# EAGLE design Datalogger (EAGLE 6.5.0)
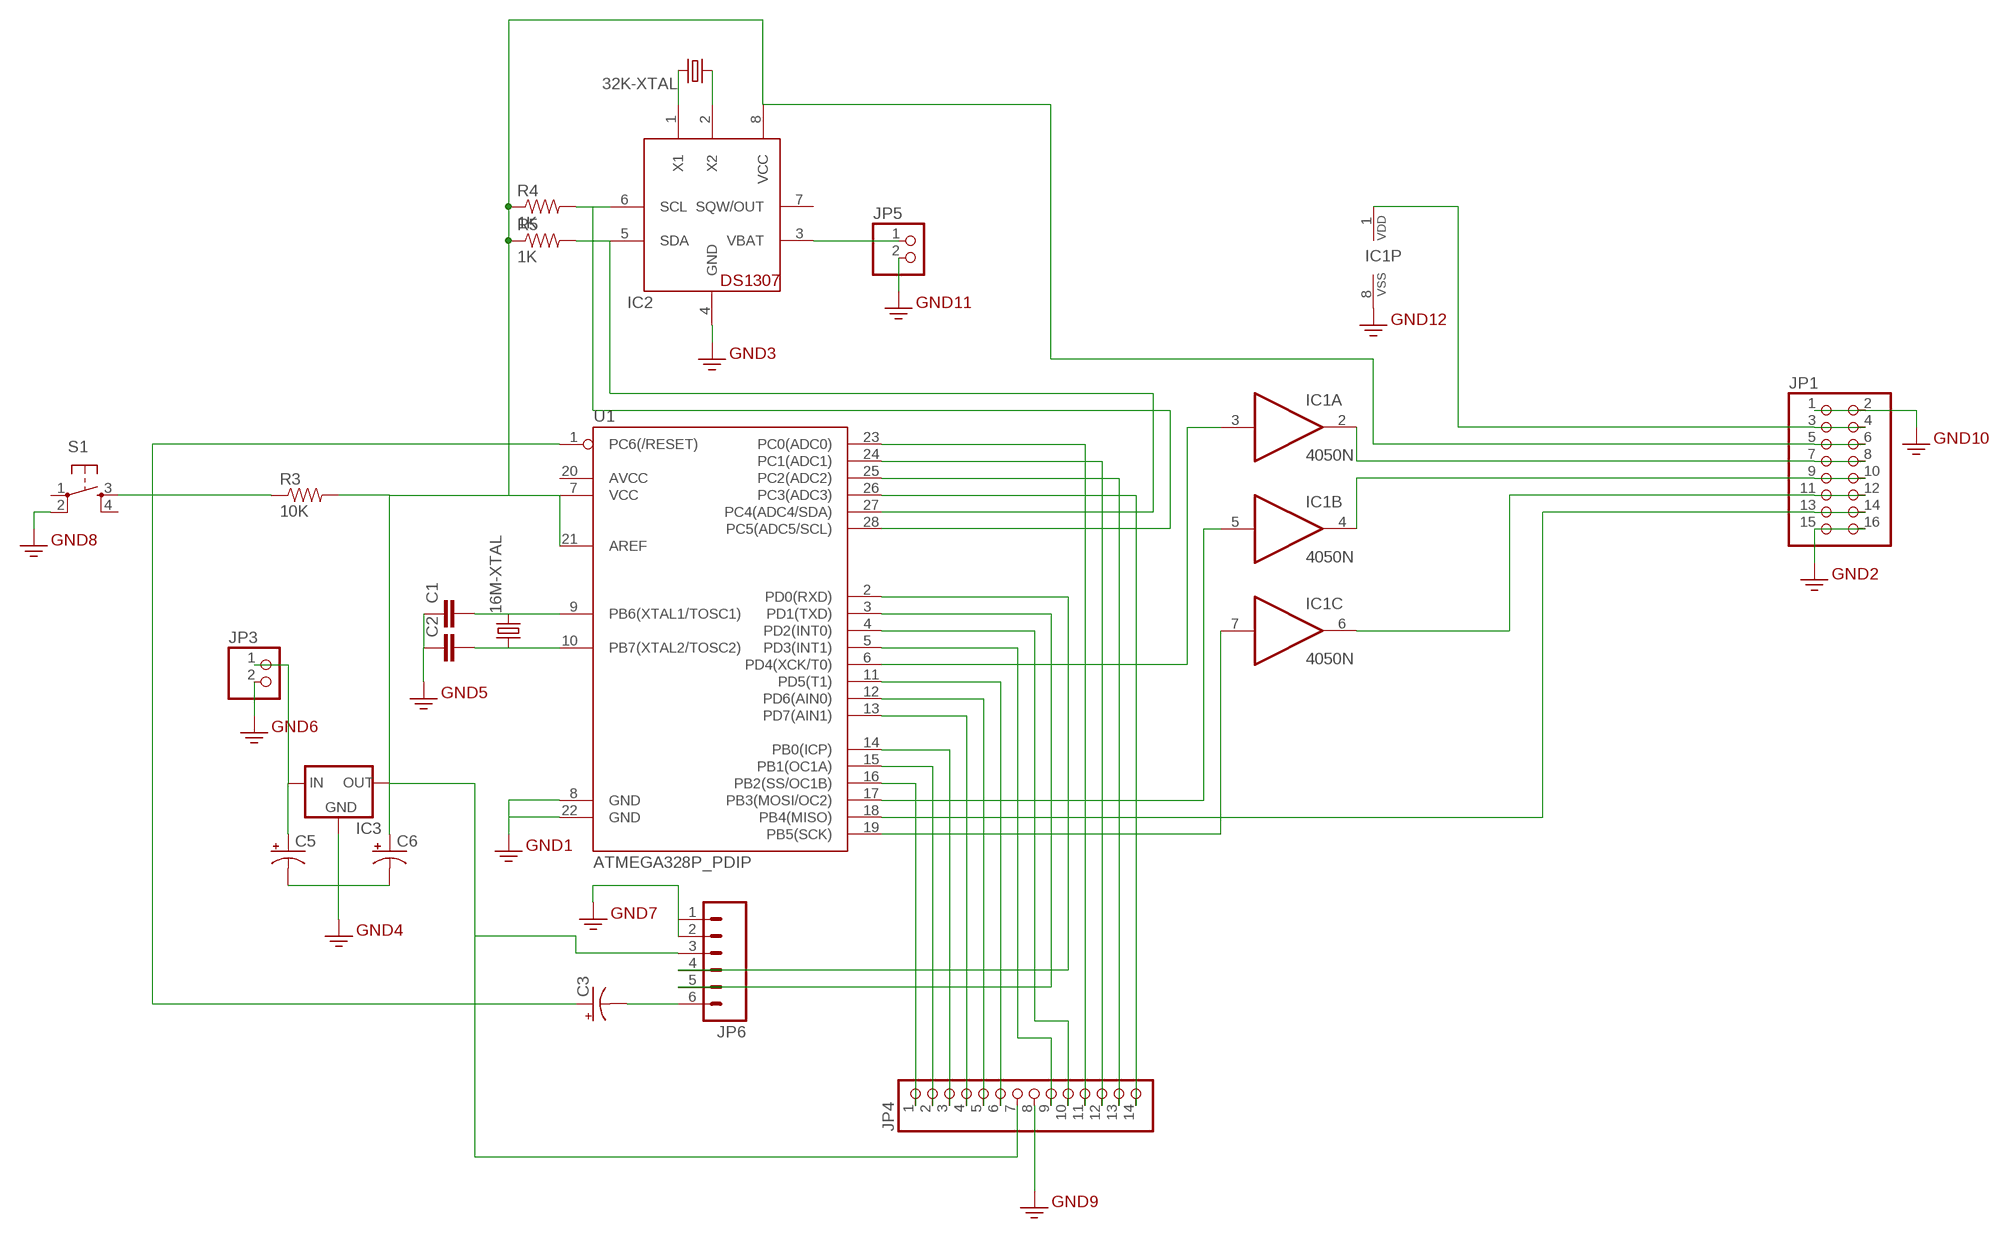
[diagram p0: schematic, sheet 1]

## Parts
16M-XTAL  CRYSTALHC49US  [HC49US]
32K-XTAL  CRYSTALTC26H_EZ  [TC26HEZ]
C1  CAPKIT  [CAP-PTH-SMALL-KIT]
C2  CAPKIT  [CAP-PTH-SMALL-KIT]
C3  CAP_POLPTH1  [CPOL-RADIAL-100UF-25V]
C5  CAP_POLPTH1  [CPOL-RADIAL-100UF-25V]
C6  CAP_POLPTH1  [CPOL-RADIAL-100UF-25V]
IC1  4050N  [DIL16]
IC2  DS1307  [DIL08]
IC3  V_REG_78XX-TO-220  [TO-220-ALT]
JP1  PINHD-2X8  [2X08]
JP3  PINHD-1X2  [1X02]
JP4  PINHD-1X14  [1X14]
JP5  PINHD-1X2  [1X02]
JP6  M06SIP  [1X06]
R3  10K  RESISTORPTH-1/4W  [AXIAL-0.4]
R4  1K  RESISTORPTH-1/4W  [AXIAL-0.4]
R5  1K  RESISTORPTH-1/4W  [AXIAL-0.4]
S1  TAC_SWITCHPTH  [TACTILE-PTH]
U1  ATMEGA328P_PDIP  [DIL28-3]

## Nets
3.3V: C1.1 C2.1 C5.2(-) C6.2(-) IC1.8(P:VSS) IC2.4(GND) IC3.GND JP1.1 JP1.2 JP1.15 JP1.16 JP3.2 JP4.8 JP5.2 JP6.1 JP6.2 S1.2 U1.8(GND) U1.22(GND) ; supply symbol labelled GND2
N$1: JP4.2 U1.15(PB1(OC1A))
N$2: 16M-XTAL.2 C1.2 U1.9(PB6(XTAL1/TOSC1))
N$3: 16M-XTAL.1 C2.2 U1.10(PB7(XTAL2/TOSC2))
N$4: IC1.2(A:O) JP1.7 JP1.8
N$5: IC1.4(B:O) JP1.9 JP1.10
N$6: IC1.6(C:O) JP1.11 JP1.12
N$7: JP1.13 JP1.14 U1.18(PB4(MISO))
N$8: C6.1(+) IC2.8(VCC) IC3.OUT JP1.5 JP1.6 JP4.7 JP6.3 R3.P$2 R4.P$1 R5.P$1 U1.7(VCC) U1.21(AREF)
N$9: IC1.1(P:VDD) JP1.3 JP1.4
N$10: IC1.3(A:I) U1.6(PD4(XCK/T0))
N$11: IC1.5(B:I) U1.17(PB3(MOSI/OC2))
N$12: IC1.7(C:I) U1.19(PB5(SCK))
N$13: 32K-XTAL.1 IC2.2(X2)
N$14: 32K-XTAL.2 IC2.1(X1)
N$15: IC2.6(SCL) R4.P$2 U1.28(PC5(ADC5/SCL))
N$16: C5.1(+) IC3.IN JP3.1
N$17: IC2.5(SDA) R5.P$2 U1.27(PC4(ADC4/SDA))
N$18: JP4.11 U1.23(PC0(ADC0))
N$19: IC2.3(VBAT) JP5.1
N$20: C3.2(-) JP6.6
N$21: JP4.12 U1.24(PC1(ADC1))
N$22: JP4.13 U1.25(PC2(ADC2))
N$23: JP4.14 U1.26(PC3(ADC3))
N$24: JP6.4 U1.2(PD0(RXD))
N$25: JP6.5 U1.3(PD1(TXD))
N$26: JP4.10 U1.4(PD2(INT0))
N$27: JP4.9 U1.5(PD3(INT1))
N$28: JP4.6 U1.11(PD5(T1))
N$29: JP4.5 U1.12(PD6(AIN0))
N$30: JP4.4 U1.13(PD7(AIN1))
N$31: JP4.3 U1.14(PB0(ICP))
N$32: C3.1(+) U1.1(PC6(/RESET))
N$33: JP4.1 U1.16(PB2(SS/OC1B))
N$35: R3.P$1 S1.3
Unconnected: IC1.9(D:I) IC1.10(D:O) IC1.11(E:I) IC1.12(E:O) IC1.14(F:I) IC1.15(F:O) IC2.7(SQW/OUT) S1.1 S1.4 U1.20(AVCC)

## Library data of the parts
16M-XTAL 32K-XTAL = SparkFun-FreqCtrl:CRYSTAL: Various standard crystals. Proven footprints. Spark Fun Electronics SKU : COM-00534
C1 C2 = SparkFun-Passives:CAP: Capacitor Standard 0603 ceramic capacitor, and 0.1" leaded capacitor.
C3 C5 C6 = SparkFun-Capacitors:CAP_POL: Capacitor Polarized These are standard SMD and PTH capacitors. Normally 10uF, 47uF, and 100uF in electrolytic and tantalum varieties. Always verify the external diameter of the through hole cap, it varies with capacity, voltage, and manufacturer. The EIA devices should be standard.
IC1 = 40xx:4050: Hex non-inverting BUFFER
IC2 = adafruit:DS1307: DS1307 Real time clock (RTC) with battery backup ability. Talk to it via i2c
IC3 = SparkFun-PowerIC:V_REG_78XX: Voltage Regulator Standard 7805 5V regulator. IGO (Input Ground Output). Spark Fun Electronics SKU : COM-00107
JP1 = pinhead:PINHD-2X8: PIN HEADER
JP3 JP5 = pinhead:PINHD-1X2: PIN HEADER
JP4 = adafruit:PINHD-1X14: PIN HEADER
JP6 = SparkFun-Connectors:M06: Header 6 Standard 6-pin 0.1" header. Use with straight break away headers (SKU : PRT-00116), right angle break away headers (PRT-00553), swiss pins (PRT-00743), machine pins (PRT-00117), and female headers (PRT-00115). Molex polarized connector foot print use with SKU : PRT-08094 with associated crimp pins and housings. NOTES ON THE VARIANTS LOCK and LOCK_LONGPADS... This footprint was designed to help hold the alignment of a through-hole component (i.e. 6-pin header) while soldering it into place. You may notice that each hole has been shifted either up or down by 0.005 of an inch from it's more standard position (which is a perfectly straight line). This slight alteration caused the pins (the squares in the middle) to touch the edges of the holes. Because they are alternating, it causes a "brace" to hold the component in place. 0.005 has proven to be the perfect amount of "off-center" position when using our standard breakaway headers. Although looks a little odd when you look at the bare footprint, once you have a header in there, the alteration is very hard to notice. Also,if you push a header all the way into place, it is covered up entirely on the bottom side. This idea of altering the position of holes to aid alignment will be further integrated into the Sparkfun Library for other footprints. It can help hold any component with 3 or more connection pins.
R3-R5 = SparkFun-Passives:RESISTOR: Resistor Basic schematic elements and footprints for 0603, 1206, and PTH resistors.
S1 = SparkFun-Electromechanical:TAC_SWITCH: Momentary Switch Button commonly used for reset or general input. Spark Fun Electronics SKU : COM-00097 SMT- SWCH-08247
U1 = SparkFun-DigitalIC:ATMEGA328P_PDIP: uC used in the Arduino 32kb flash, 1k EEPROM, 2k SRAM This is the through-hole version of this chip.

## Board
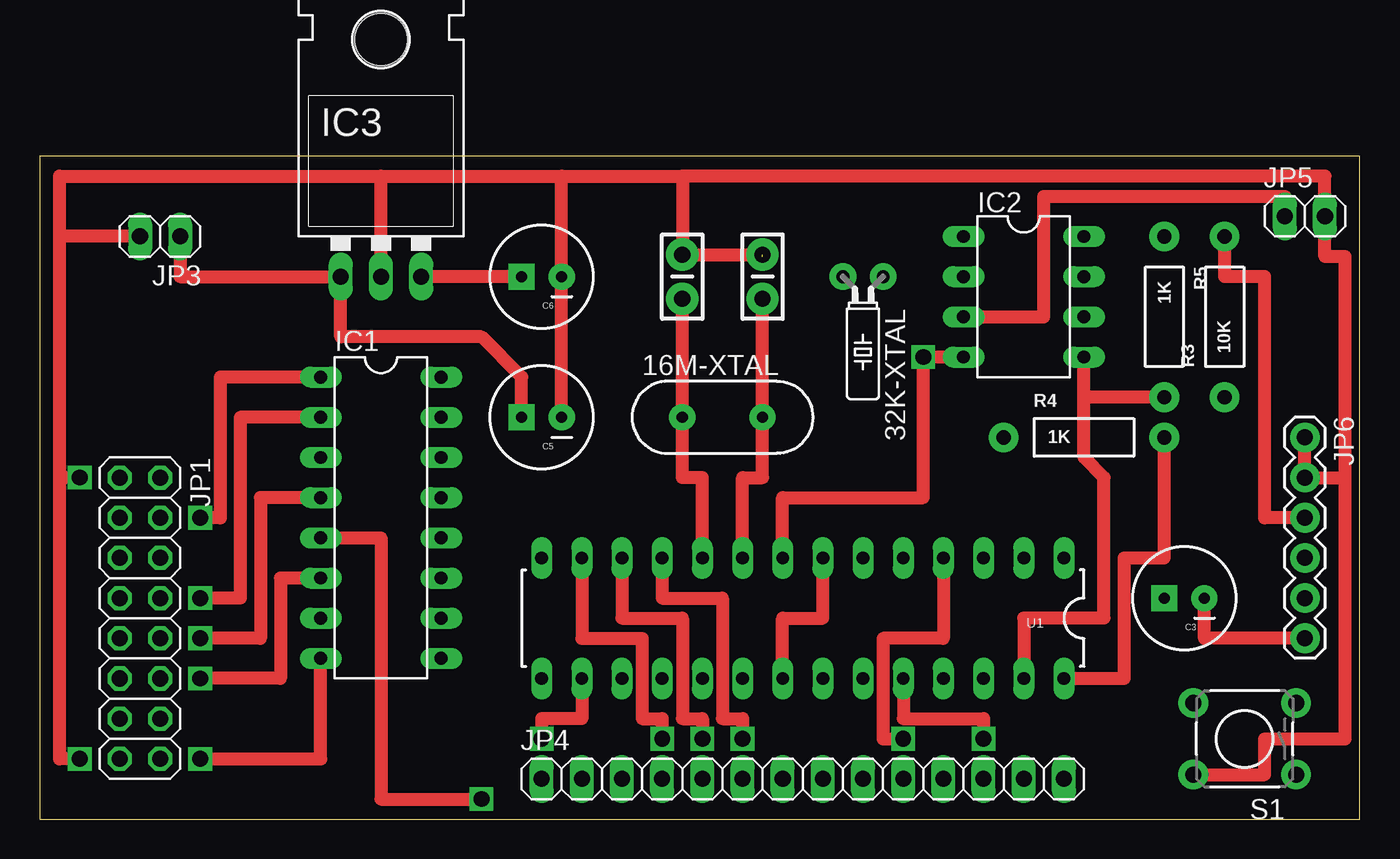
[diagram p1: board, top side]
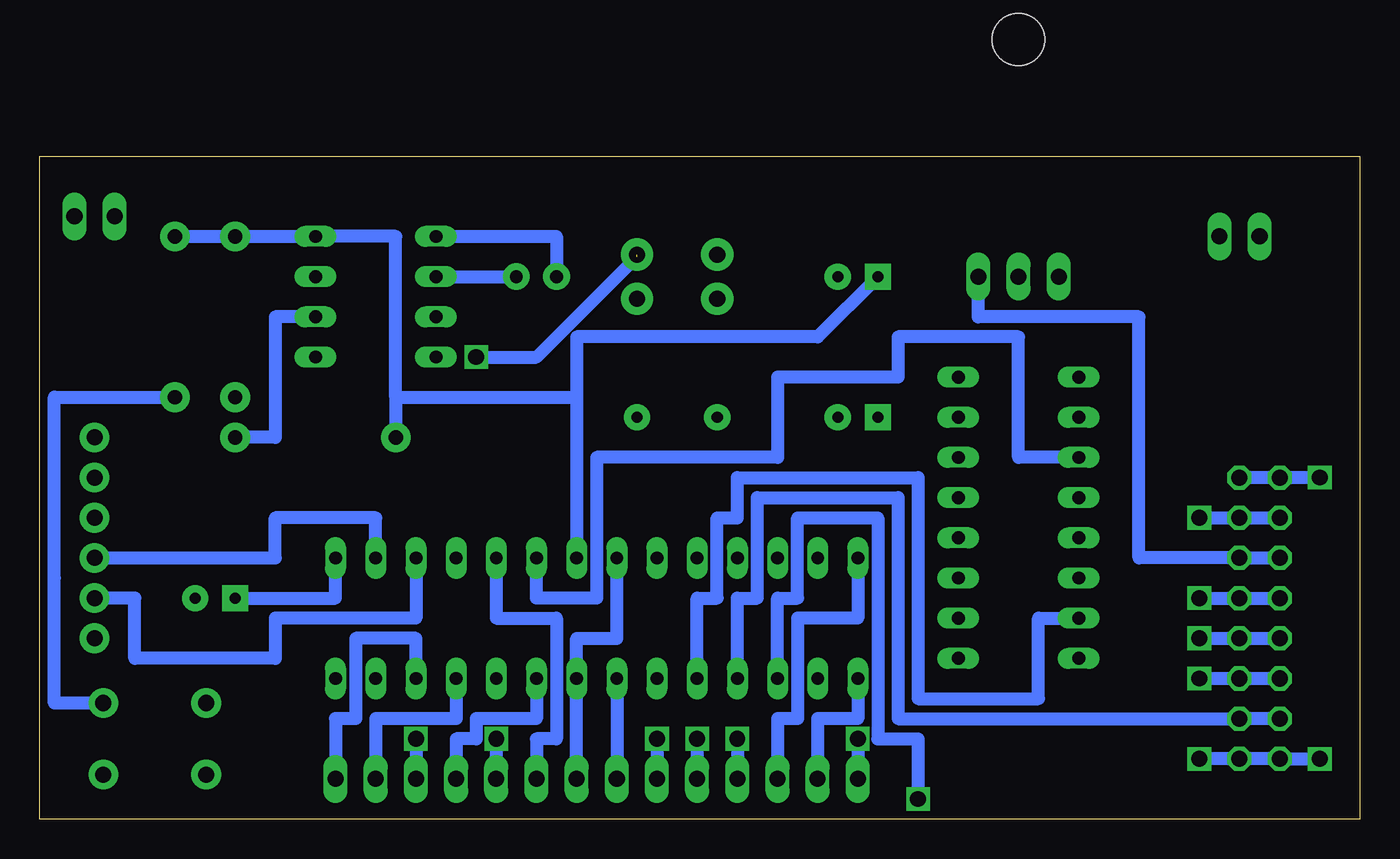
[diagram p2: board, bottom side, seen from below]

Size 83.49 x 41.9 mm. Coordinates in mm from the lower left corner, seen from the top.
Outline: 0,0 83.49,0 83.49,41.9 0,41.9 0,0
Copper layers (1*16): Top 0.035mm / dielectric 1.5mm / Bottom 0.035mm
Design rules "default": minimum track width 10mil, minimum drill 24mil, track to track 8mil, track to pad 8mil, pad to pad 8mil, via to via 8mil, smd to smd 8mil, copper to edge 40mil, drill to drill 8mil, minimum pad ring 10mil, minimum via ring 8mil, stop-mask expansion 4mil, vias tented up to drill 0mil, thermal gap 10mil

### Footprints (pad centres in the part's own frame; a part is rotated, then mirrored left to right if it is on the bottom)
HC49US = drill 0.7 pad 1.651: 1 -2.54,0; 2 2.54,0
TC26HEZ = drill 0.813 pad 1.676: 1 -1.27,0; 2 1.27,0
CAP-PTH-SMALL-KIT = drill 1.016 pad 2.032: 1 -1.397,0; 2 1.397,0
CPOL-RADIAL-100UF-25V = drill 0.7 pad 1.651 square: 1 1.27,0 | drill 0.7 pad 1.651: 2 -1.27,0
DIL16 = drill 0.813 long: 1 -8.89,-3.81; 2 -6.35,-3.81; 3 -3.81,-3.81; 4 -1.27,-3.81; 5 1.27,-3.81; 6 3.81,-3.81; 7 6.35,-3.81; 8 8.89,-3.81; 9 8.89,3.81; 10 6.35,3.81; 11 3.81,3.81; 12 1.27,3.81; 13 -1.27,3.81; 14 -3.81,3.81; 15 -6.35,3.81; 16 -8.89,3.81
DIL08 = drill 0.813 long: 1 -3.81,-3.81; 2 -1.27,-3.81; 3 1.27,-3.81; 4 3.81,-3.81; 5 3.81,3.81; 6 1.27,3.81; 7 -1.27,3.81; 8 -3.81,3.81
TO-220-ALT = drill 1.016 long: GND 0,-3.81; IN -2.54,-3.81; OUT 2.54,-3.81 | hole 3.302: 0,11.176
2X08 = drill 1.016 octagon: 1 -8.89,-1.27; 2 -8.89,1.27; 3 -6.35,-1.27; 4 -6.35,1.27; 5 -3.81,-1.27; 6 -3.81,1.27; 7 -1.27,-1.27; 8 -1.27,1.27; 9 1.27,-1.27; 10 1.27,1.27; 11 3.81,-1.27; 12 3.81,1.27; 13 6.35,-1.27; 14 6.35,1.27; 15 8.89,-1.27; 16 8.89,1.27
1X02 = drill 1.016 long: 1 -1.27,0; 2 1.27,0
1X14 = drill 1.016 long: 1 -16.51,0; 2 -13.97,0; 3 -11.43,0; 4 -8.89,0; 5 -6.35,0; 6 -3.81,0; 7 -1.27,0; 8 1.27,0; 9 3.81,0; 10 6.35,0; 11 8.89,0; 12 11.43,0; 13 13.97,0; 14 16.51,0
1X06 = drill 1.016 pad 1.88: 1 0,0; 2 2.54,0; 3 5.08,0; 4 7.62,0; 5 10.16,0; 6 12.7,0
AXIAL-0.4 = drill 0.9 pad 1.88: P$1 -5.08,0; P$2 5.08,0
TACTILE-PTH = drill 1.016 pad 1.88: 1 -3.251,2.261; 2 3.251,2.261; 3 -3.251,-2.261; 4 3.251,-2.261
DIL28-3 = drill 0.813 long: 1 -16.51,-3.81; 2 -13.97,-3.81; 3 -11.43,-3.81; 4 -8.89,-3.81; 5 -6.35,-3.81; 6 -3.81,-3.81; 7 -1.27,-3.81; 8 1.27,-3.81; 9 3.81,-3.81; 10 6.35,-3.81; 11 8.89,-3.81; 12 11.43,-3.81; 13 13.97,-3.81; 14 16.51,-3.81; 15 16.51,3.81; 16 13.97,3.81; 17 11.43,3.81; 18 8.89,3.81; 19 6.35,3.81; 20 3.81,3.81; 21 1.27,3.81; 22 -1.27,3.81; 23 -3.81,3.81; 24 -6.35,3.81; 25 -8.89,3.81; 26 -11.43,3.81; 27 -13.97,3.81; 28 -16.51,3.81

### Placement (x,y rotation side)
16M-XTAL  43.18,25.4 0 top
32K-XTAL  52.07,34.29 180 top
C1  45.72,34.29 270 top
C2  40.64,34.29 270 top
C3  72.39,13.97 180 top
C5  31.75,25.4 180 top
C6  31.75,34.29 180 top
IC1  21.59,19.05 270 top
IC2  62.23,33.02 270 top
IC3  21.59,38.1 0 top
JP1  6.35,12.7 270 top
JP3  7.62,36.83 180 top
JP4  48.26,2.54 0 top
JP5  80.01,38.1 0 top
JP6  80.01,24.13 270 top
R3  74.93,31.75 90 top
R4  66.04,24.13 0 top
R5  71.12,31.75 270 top
S1  76.2,5.08 180 top
U1  48.26,12.7 180 top

### Tracks (layer width: path | path; a pad name or v marks a point on that pad's centre or on a via)
3.3V  (via drill 1)  (1 unrouted)
  Top 0.813: v2.54,3.81 1.27,3.81 1.27,21.59 | 1.27,21.59 1.27,36.83 | 1.27,36.83 1.27,40.64 21.59,40.64 | C5.2 C6.2 33.02,40.64 | IC3.GND 21.59,40.64 | 21.59,40.64 33.02,40.64 | 33.02,40.64 40.64,40.64 | 40.64,40.64 C2.1 C1.1 | IC2.4 v55.88,29.21 55.88,20.32 46.99,20.32 U1.8 | JP3.2 1.27,36.83 | 40.64,40.64 81.28,40.64 JP5.2 81.28,35.56 82.55,35.56 82.55,21.59 | v2.54,21.59 1.27,21.59 | v10.16,3.81 17.78,3.81 IC1.8 | S1.2 77.47,2.82 77.47,5.08 82.55,5.08 82.55,21.59 | 82.55,21.59 JP6.2 JP6.1
  Bottom 0.813: v2.54,3.81 JP1.15 JP1.16 v10.16,3.81 | v55.88,29.21 52.07,29.21 45.72,35.56 | U1.8 46.99,11.43 49.53,11.43 U1.22 JP4.8 | v2.54,21.59 JP1.1 JP1.2
N$1
  Bottom 0.813: U1.15 31.75,6.35 34.29,6.35 JP4.2
N$2
  Top 0.813: U1.9 44.45,21.59 45.72,21.59 16M-XTAL.2 C1.2
N$3
  Top 0.813: U1.10 41.91,21.59 40.64,21.59 16M-XTAL.1 C2.2
N$4  (via drill 1)
  Top 0.813: IC1.2 12.7,25.4 12.7,13.97 | 12.7,13.97 v10.16,13.97 12.7,13.97
  Bottom 0.813: JP1.7 JP1.8 v10.16,13.97
N$5  (via drill 1)
  Top 0.813: IC1.4 13.97,20.32 13.97,11.43 v10.16,11.43
  Bottom 0.813: JP1.9 JP1.10 v10.16,11.43
N$6  (via drill 1)
  Top 0.813: IC1.6 15.24,15.24 15.24,8.89 v10.16,8.89
  Bottom 0.813: v10.16,8.89 JP1.12 JP1.11
N$7
  Bottom 0.813: U1.18 39.37,13.97 38.1,13.97 38.1,20.32 29.21,20.32 29.21,6.35 JP1.14 JP1.13
N$8
  Top 0.813: C6.1 IC3.OUT | U1.21 46.99,12.7 49.53,12.7 U1.7 | JP6.3 77.47,19.05 77.47,34.29 74.93,34.29 R3.P$2
  Bottom 0.813: JP1.5 JP1.6 13.97,16.51 13.97,31.75 24.13,31.75 IC3.OUT | 49.53,26.67 49.53,30.48 34.29,30.48 C6.1 | 49.53,26.67 U1.7 | 60.96,26.67 49.53,26.67 | U1.21 JP4.7 | 60.96,26.67 R4.P$1 | 60.96,26.67 60.96,36.83 IC2.8 R5.P$1 R3.P$2
N$9  (via drill 1)
  Top 0.813: IC1.1 11.43,27.94 11.43,19.05 v10.16,19.05
  Bottom 0.813: JP1.3 JP1.4 v10.16,19.05
N$10
  Bottom 0.813: IC1.3 21.59,22.86 21.59,30.48 29.21,30.48 29.21,27.94 36.83,27.94 36.83,22.86 48.26,22.86 48.26,13.97 52.07,13.97 U1.6
N$11  (via drill 1)
  Top 0.813: IC1.5 21.59,17.78 21.59,1.27 v27.94,1.27
  Bottom 0.813: U1.17 36.83,13.97 35.56,13.97 35.56,19.05 30.48,19.05 30.48,5.08 27.94,5.08 v27.94,1.27
N$12
  Bottom 0.813: U1.19 41.91,13.97 40.64,13.97 40.64,19.05 39.37,19.05 39.37,21.59 27.94,21.59 27.94,7.62 20.32,7.62 20.32,12.7 IC1.7
N$13
  Bottom 0.813: IC2.2 32K-XTAL.1
N$14
  Bottom 0.813: IC2.1 50.8,36.83 32K-XTAL.2
N$15
  Top 0.813: U1.28 68.58,8.89 68.58,16.51 71.12,16.51 R4.P$2
  Bottom 0.813: IC2.6 68.58,31.75 68.58,24.13 R4.P$2
N$16
  Top 0.813: C5.1 30.48,27.94 27.94,30.48 19.05,30.48 IC3.IN 8.89,34.29 JP3.1
N$17
  Top 0.813: 66.04,26.67 66.04,22.86 67.31,21.59 67.31,12.7 62.23,12.7 U1.27 | 66.04,26.67 IC2.5 | R5.P$2 66.04,26.67
N$18
  Bottom 0.813: U1.23 52.07,6.35 55.88,6.35 55.88,5.08 57.15,5.08 JP4.11
N$19
  Top 0.813: IC2.3 63.5,31.75 63.5,39.37 78.74,39.37 JP5.1
N$20
  Top 0.813: JP6.6 73.66,11.43 C3.2
N$21  (via drill 1)
  Top 0.813: U1.24 54.61,6.35 59.69,6.35 v59.69,5.08
  Bottom 0.813: v59.69,5.08 JP4.12
N$22
  Bottom 0.813: JP4.13 62.23,6.35 57.15,6.35 U1.25
N$23
  Bottom 0.813: U1.26 59.69,11.43 63.5,11.43 63.5,6.35 64.77,6.35 JP4.14
N$24
  Bottom 0.813: U1.2 62.23,19.05 68.58,19.05 68.58,16.51 JP6.4
N$25
  Bottom 0.813: U1.3 59.69,12.7 68.58,12.7 68.58,10.16 77.47,10.16 77.47,13.97 JP6.5
N$26  (via drill 1)
  Top 0.813: U1.4 57.15,11.43 53.34,11.43 53.34,5.08 v54.61,5.08
  Bottom 0.813: v54.61,5.08 JP4.10
N$27
  Bottom 0.813: U1.5 54.61,12.7 50.8,12.7 50.8,5.08 52.07,5.08 JP4.9
N$28  (via drill 1)
  Top 0.813: U1.11 39.37,13.97 43.18,13.97 43.18,6.35 44.45,6.35 v44.45,5.08
  Bottom 0.813: v44.45,5.08 JP4.6
N$29  (via drill 1)
  Top 0.813: U1.12 36.83,12.7 40.64,12.7 40.64,6.35 41.91,6.35 v41.91,5.08
  Bottom 0.813: v41.91,5.08 JP4.5
N$30  (via drill 1)
  Top 0.813: U1.13 34.29,11.43 38.1,11.43 38.1,6.35 39.37,6.35 v39.37,5.08
  Bottom 0.813: v39.37,5.08 JP4.4
N$31
  Bottom 0.813: U1.14 31.75,12.7 35.56,12.7 35.56,6.35 36.83,6.35 JP4.3
N$32
  Bottom 0.813: C3.1 64.77,13.97 U1.1
N$33  (via drill 1)
  Top 0.813: U1.16 34.29,6.35 31.75,6.35 v31.75,5.08
  Bottom 0.813: v31.75,5.08 JP4.1
N$35
  Bottom 0.813: R3.P$1 82.55,26.67 82.55,15.24 82.55,7.34 S1.3